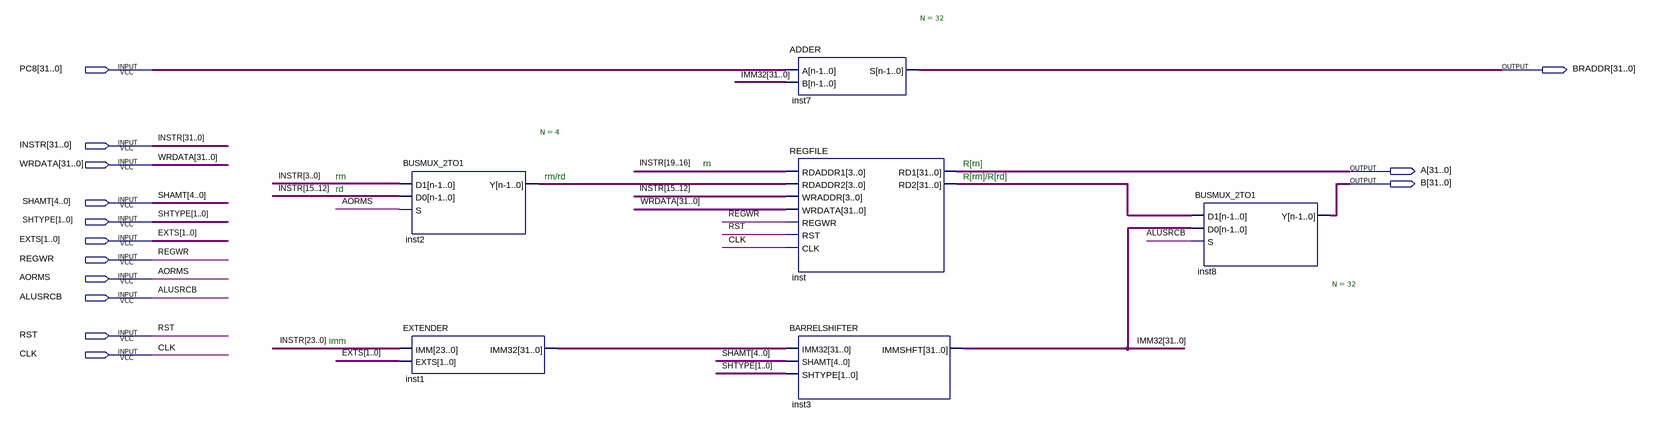
[diagram p0: schematic sheet]
// Quartus schematic DECODE.bdf as structural Verilog: 6 symbols, 14 pins
module DECODE (
  input  [31:0] PC8,
  input  [31:0] INSTR,
  input  [31:0] WRDATA,
  input  [4:0] SHAMT,
  input  [1:0] SHTYPE,
  input  [1:0] EXTS,
  input  REGWR,
  input  AORMS,
  input  ALUSRCB,
  input  RST,
  input  CLK,
  output [31:0] BRADDR,
  output [31:0] A,
  output [31:0] B
);

  wire [3:0] inst2_y;
  wire [31:0] IMM32, inst1_imm32, inst_rd2;

  BUSMUX_2TO1 #(.N(4)) inst2 (.D1(INSTR[3:0]), .D0(INSTR[15:12]), .S(AORMS), .Y(inst2_y));
  EXTENDER inst1 (.IMM(INSTR[23:0]), .EXTS(EXTS), .IMM32(inst1_imm32));
  ADDER #(.N(32)) inst7 (.A(PC8), .B(IMM32), .S(BRADDR));
  REGFILE inst (
    .RDADDR1(INSTR[19:16]), .RDADDR2(inst2_y), .WRADDR(INSTR[15:12]), .WRDATA(WRDATA), .REGWR(REGWR),
    .RST(RST), .CLK(CLK), .RD1(A), .RD2(inst_rd2));
  BARRELSHIFTER inst3 (.IMM32(inst1_imm32), .SHAMT(SHAMT), .SHTYPE(SHTYPE), .IMMSHFT(IMM32));
  BUSMUX_2TO1 #(.N(32)) inst8 (.D1(inst_rd2), .D0(IMM32), .S(ALUSRCB), .Y(B));

  // Notes on the sheet:
  //   rn
  //   R[rn]
  //   rm
  //   rm/rd
  //   R[rm]/R[rd]
  //   rd
  //   imm
endmodule
